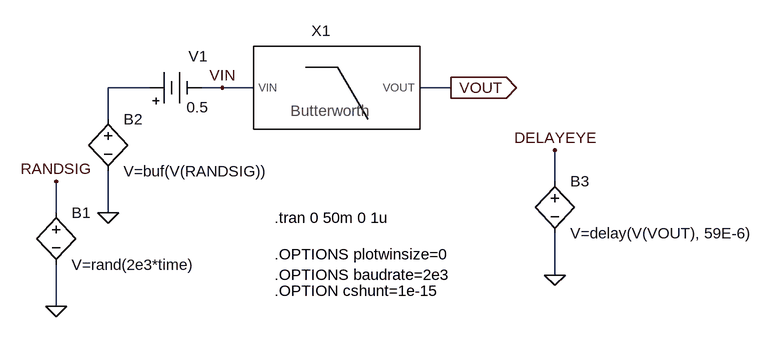
[diagram p0: schematic fig-02-07-18.asc]
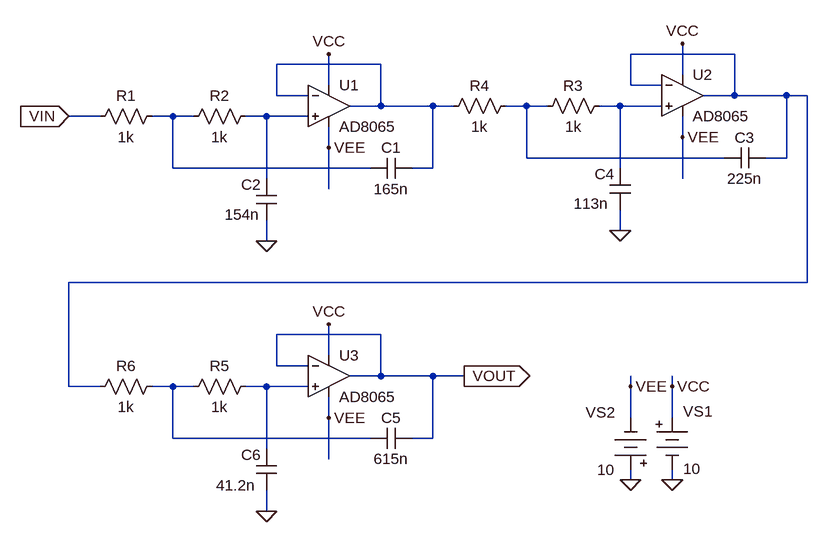
[diagram p1: sub-circuit fig-02-07-15-sub.asc]
fig-02-07-18.asc, the LTspice schematic file:
Version 4
SHEET 1 1012 804
WIRE -192 176 -256 176
WIRE -80 176 -112 176
WIRE -32 176 -80 176
WIRE 272 176 224 176
WIRE -256 224 -256 176
WIRE 432 320 432 272
WIRE -336 368 -336 320
WIRE -256 368 -256 304
WIRE 432 464 432 400
WIRE -336 512 -336 448
FLAG 272 176 VOUT
IOPIN 272 176 Out
FLAG -336 512 0
FLAG -336 320 RANDSIG
FLAG -256 368 0
FLAG 432 464 0
FLAG 432 272 DELAYEYE
FLAG -80 176 VIN
SYMBOL Misc\\battery -208 176 R270
WINDOW 0 49 76 VRight 2
WINDOW 3 -30 73 VRight 2
WINDOW 123 0 0 Left 2
WINDOW 39 0 0 Left 2
SYMATTR InstName V1
SYMATTR Value 0.5
SYMBOL bv -336 352 R0
SYMATTR InstName B1
SYMATTR Value V=rand(2e3*time)
SYMBOL bv -256 208 R0
SYMATTR InstName B2
SYMATTR Value V=buf(V(RANDSIG))
SYMBOL bv 432 304 R0
SYMATTR InstName B3
SYMATTR Value V=delay(V(VOUT), 59E-6)
SYMBOL fig-02-07-15-sub 64 176 R0
SYMATTR InstName X1
TEXT 0 376 Left 2 !.tran 0 50m 0 1u
TEXT 0 432 Left 2 !.OPTIONS plotwinsize=0\n.OPTIONS baudrate=2e3
TEXT 0 488 Left 2 !.OPTION cshunt=1e-15

fig-02-07-15-sub.asc, the sub-circuit schematic file:
Version 4
SHEET 1 1324 804
WIRE 816 80 656 80
WIRE 272 96 112 96
WIRE 736 112 736 64
WIRE 192 128 192 80
WIRE 656 128 656 80
WIRE 704 128 656 128
WIRE 112 144 112 96
WIRE 160 144 112 144
WIRE 816 144 816 80
WIRE 816 144 768 144
WIRE 896 144 816 144
WIRE 928 144 896 144
WIRE 272 160 272 96
WIRE 272 160 224 160
WIRE 352 160 272 160
WIRE 384 160 352 160
WIRE 496 160 464 160
WIRE 528 160 496 160
WIRE 640 160 608 160
WIRE 704 160 640 160
WIRE -160 176 -208 176
WIRE -48 176 -80 176
WIRE -16 176 -48 176
WIRE 96 176 64 176
WIRE 160 176 96 176
WIRE 736 208 736 176
WIRE 192 224 192 192
WIRE 496 240 496 160
WIRE 800 240 496 240
WIRE 896 240 896 144
WIRE 896 240 864 240
WIRE -48 256 -48 176
WIRE 256 256 -48 256
WIRE 352 256 352 160
WIRE 352 256 320 256
WIRE 640 256 640 160
WIRE 96 272 96 176
WIRE 736 272 736 208
WIRE 192 288 192 224
WIRE 640 352 640 320
WIRE 96 368 96 336
WIRE 928 432 928 144
WIRE 928 432 -208 432
WIRE 272 512 112 512
WIRE 192 544 192 496
WIRE 112 560 112 512
WIRE 160 560 112 560
WIRE 272 576 272 512
WIRE 272 576 224 576
WIRE 352 576 272 576
WIRE 400 576 352 576
WIRE -208 592 -208 432
WIRE -160 592 -208 592
WIRE -48 592 -80 592
WIRE -16 592 -48 592
WIRE 96 592 64 592
WIRE 160 592 96 592
WIRE 656 592 656 576
WIRE 720 592 720 576
WIRE 192 640 192 608
WIRE 656 640 656 592
WIRE 720 640 720 592
WIRE -48 672 -48 592
WIRE 256 672 -48 672
WIRE 352 672 352 576
WIRE 352 672 320 672
WIRE 96 688 96 592
WIRE 192 704 192 640
WIRE 656 736 656 720
WIRE 720 736 720 720
WIRE 96 784 96 752
FLAG 96 368 0
FLAG 192 80 VCC
FLAG 192 224 VEE
FLAG 640 352 0
FLAG 736 64 VCC
FLAG 736 208 VEE
FLAG 96 784 0
FLAG 400 576 VOUT
IOPIN 400 576 Out
FLAG 192 496 VCC
FLAG 192 640 VEE
FLAG 656 736 0
FLAG 720 736 0
FLAG 656 592 VEE
FLAG 720 592 VCC
FLAG -208 176 VIN
IOPIN -208 176 In
SYMBOL cap 80 272 R0
WINDOW 0 -23 9 Left 2
WINDOW 3 -48 55 Left 2
SYMATTR InstName C2
SYMATTR Value 154n
SYMBOL cap 320 240 R90
WINDOW 0 0 32 VBottom 2
WINDOW 3 32 32 VTop 2
SYMATTR InstName C1
SYMATTR Value 165n
SYMBOL res 80 160 R90
WINDOW 0 0 56 VBottom 2
WINDOW 3 32 56 VTop 2
SYMATTR InstName R2
SYMATTR Value 1k
SYMBOL res -64 160 R90
WINDOW 0 0 56 VBottom 2
WINDOW 3 32 56 VTop 2
SYMATTR InstName R1
SYMATTR Value 1k
SYMBOL cap 624 256 R0
WINDOW 0 -23 9 Left 2
WINDOW 3 -55 54 Left 2
SYMATTR InstName C4
SYMATTR Value 113n
SYMBOL cap 864 224 R90
WINDOW 0 0 32 VBottom 2
WINDOW 3 32 32 VTop 2
SYMATTR InstName C3
SYMATTR Value 225n
SYMBOL res 624 144 R90
WINDOW 0 0 56 VBottom 2
WINDOW 3 32 56 VTop 2
SYMATTR InstName R3
SYMATTR Value 1k
SYMBOL res 480 144 R90
WINDOW 0 0 56 VBottom 2
WINDOW 3 32 56 VTop 2
SYMATTR InstName R4
SYMATTR Value 1k
SYMBOL cap 80 688 R0
WINDOW 0 -23 9 Left 2
WINDOW 3 -61 56 Left 2
SYMATTR InstName C6
SYMATTR Value 41.2n
SYMBOL cap 320 656 R90
WINDOW 0 0 32 VBottom 2
WINDOW 3 32 32 VTop 2
SYMATTR InstName C5
SYMATTR Value 615n
SYMBOL res 80 576 R90
WINDOW 0 0 56 VBottom 2
WINDOW 3 32 56 VTop 2
SYMATTR InstName R5
SYMATTR Value 1k
SYMBOL res -64 576 R90
WINDOW 0 0 56 VBottom 2
WINDOW 3 32 56 VTop 2
SYMATTR InstName R6
SYMATTR Value 1k
SYMBOL Misc\\battery 720 624 R0
WINDOW 0 17 6 Left 2
WINDOW 3 17 95 Left 2
SYMATTR InstName VS1
SYMATTR Value 10
SYMBOL Misc\\battery 656 736 R180
WINDOW 0 24 104 Left 2
WINDOW 3 24 16 Left 2
WINDOW 123 0 0 Left 0
WINDOW 39 0 0 Left 0
SYMATTR InstName VS2
SYMATTR Value 10
SYMBOL Opamps\\AD8065 192 96 R0
SYMATTR InstName U1
SYMBOL Opamps\\AD8065 736 80 R0
SYMATTR InstName U2
SYMBOL Opamps\\AD8065 192 512 R0
SYMATTR InstName U3

The netlist it stands for:
* fig-02-07-18.asc
V1 N001 VIN 0.5
B1 RANDSIG 0 V=rand(2e3*time)
B2 N001 0 V=buf(V(RANDSIG))
B3 DELAYEYE 0 V=delay(V(VOUT), 59E-6)
XX1 VIN VOUT fig-02-07-15-sub

* block symbol definitions
.subckt fig-02-07-15-sub VIN VOUT
C2 N006 0 154n
C1 N002 N005 165n
R2 N006 N005 1k
R1 N005 VIN 1k
C4 N004 0 113n
C3 N001 N003 225n
R3 N004 N003 1k
R4 N003 N002 1k
C6 N008 0 41.2n
C5 VOUT N007 615n
R5 N008 N007 1k
R6 N007 N001 1k
VS1 VCC 0 10
VS2 0 VEE 10
XU1 N006 N002 VCC VEE N002 AD8065  ; pins In+ In- V+ V- OUT
XU2 N004 N001 VCC VEE N001 AD8065  ; pins In+ In- V+ V- OUT
XU3 N008 VOUT VCC VEE VOUT AD8065  ; pins In+ In- V+ V- OUT
.ends fig-02-07-15-sub

.tran 0 50m 0 1u
.OPTIONS plotwinsize=0
.OPTIONS baudrate=2e3
.OPTION cshunt=1e-15
.backanno
.end